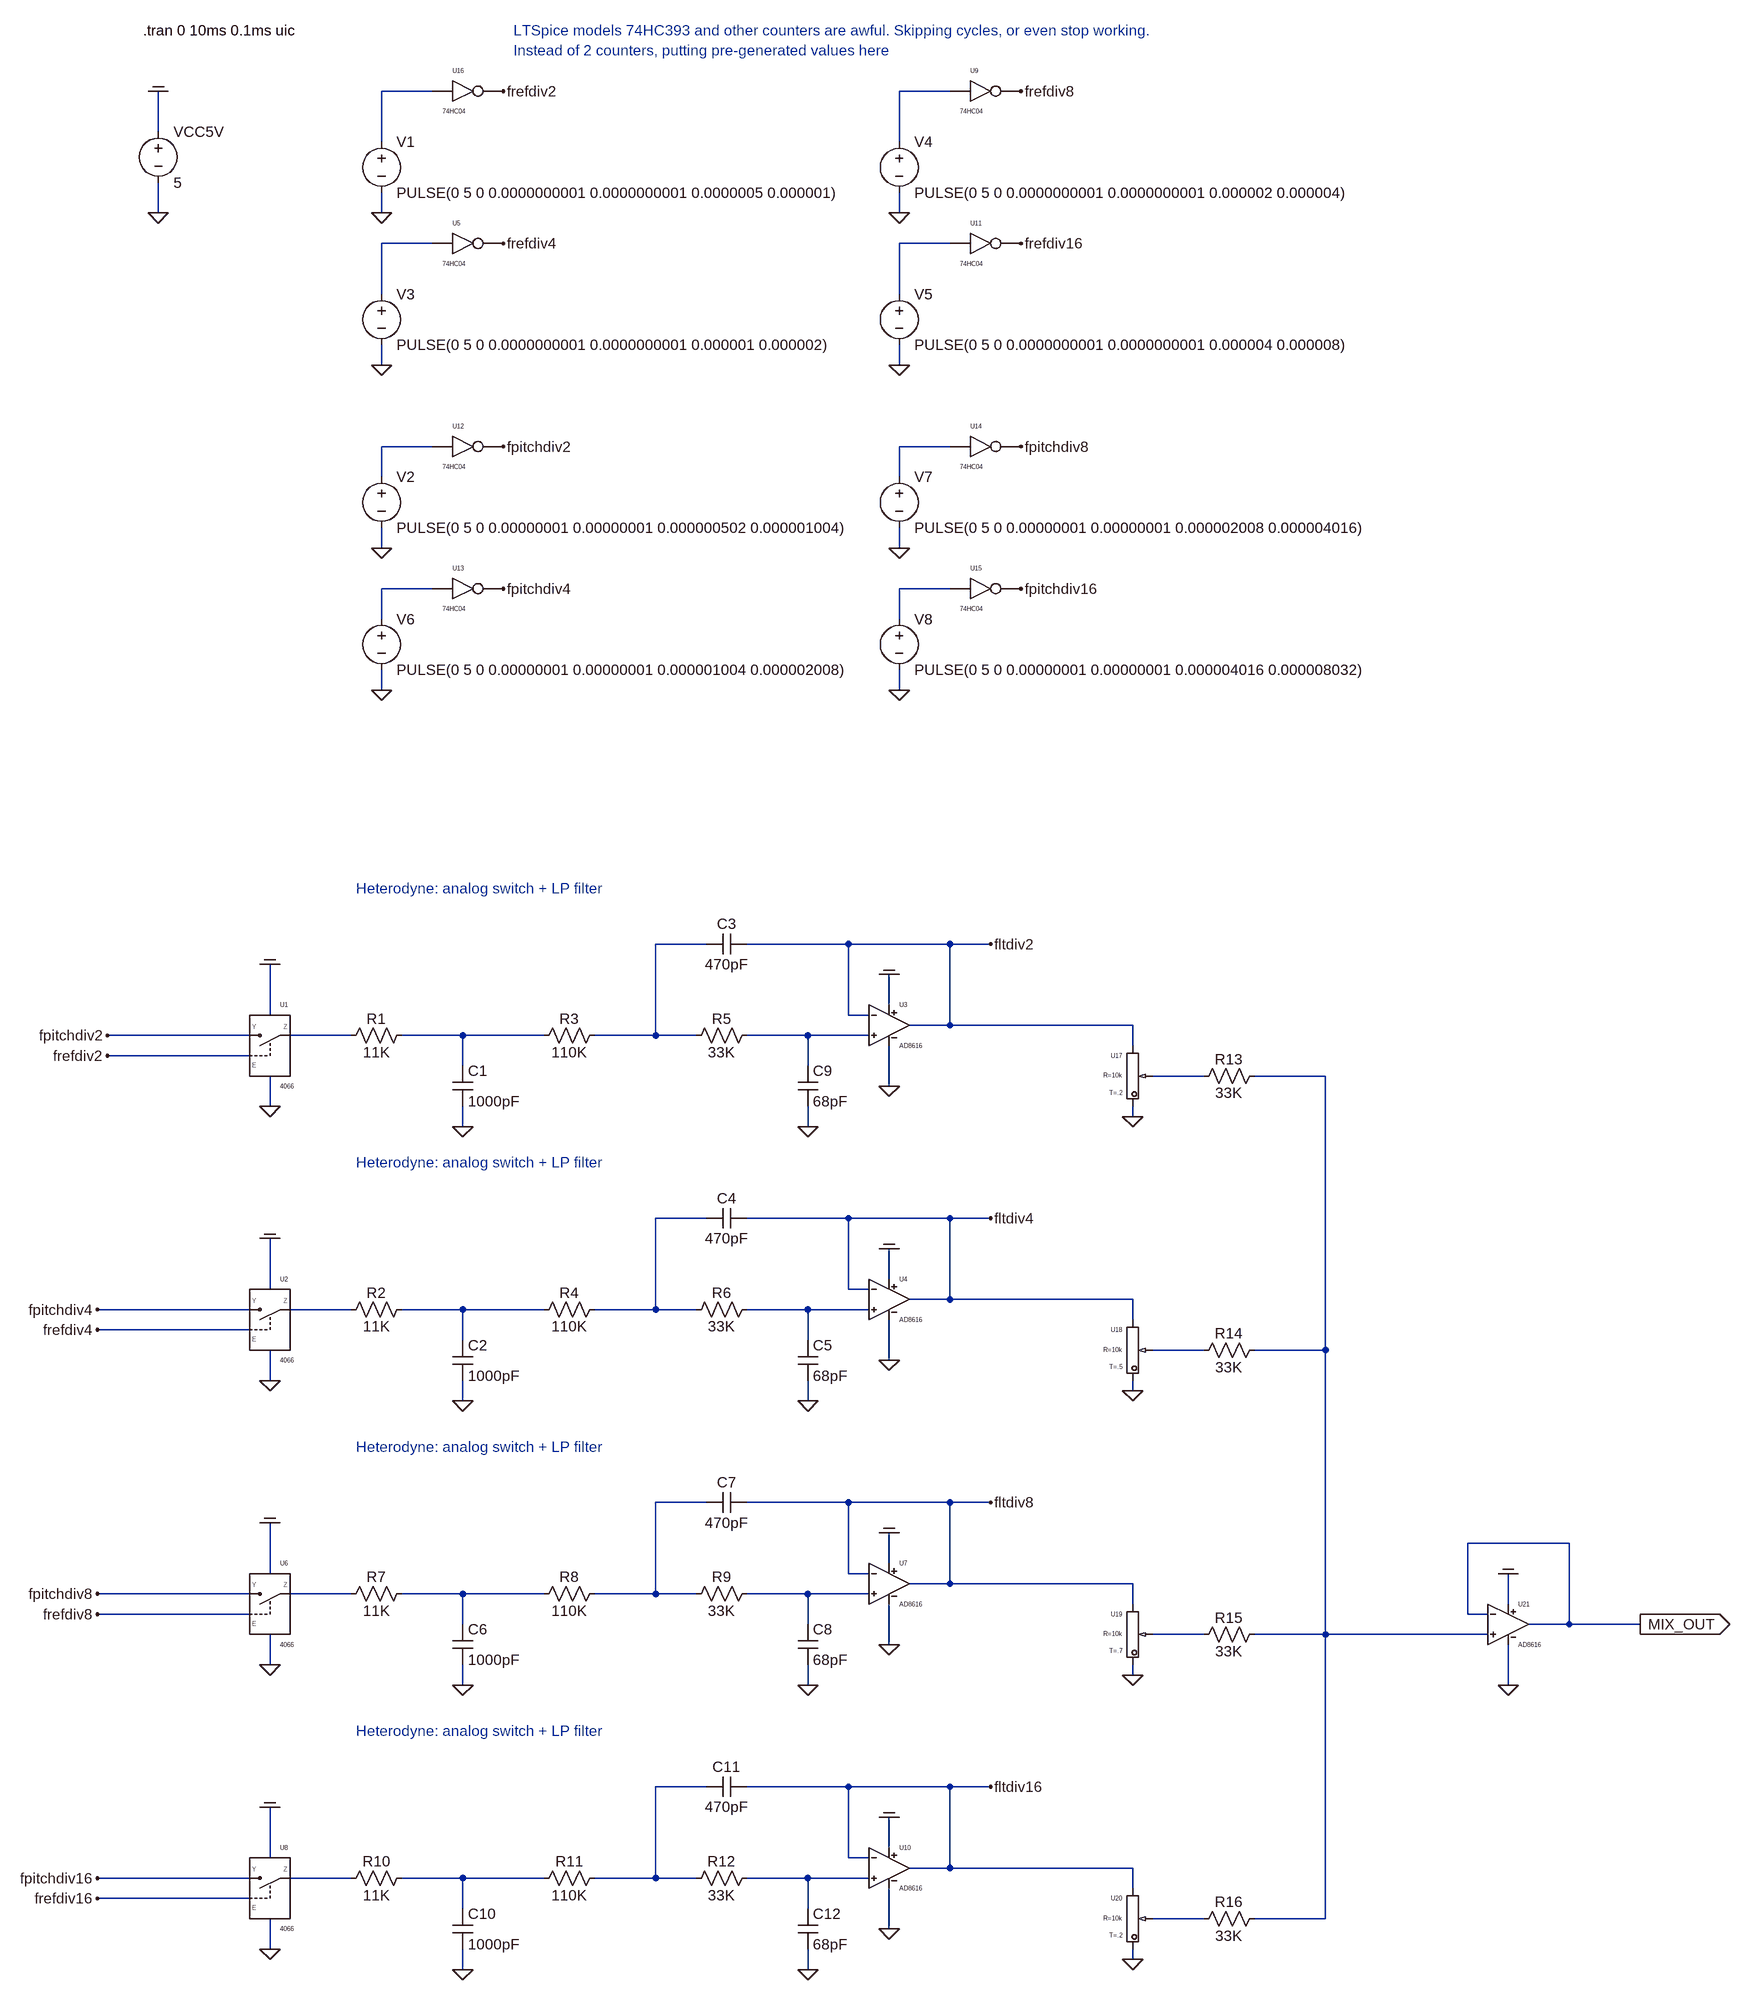
[diagram p0: schematic paradox_mixer_v2_simple.asc]
paradox_mixer_v2_simple.asc, the LTspice schematic file:
Version 4
SHEET 1 880 1476
WIRE -3904 -1616 -3984 -1616
WIRE -3088 -1616 -3168 -1616
WIRE -4336 -1552 -4336 -1616
WIRE -3984 -1536 -3984 -1616
WIRE -3168 -1536 -3168 -1616
WIRE -4336 -1424 -4336 -1472
WIRE -3984 -1424 -3984 -1456
WIRE -3168 -1424 -3168 -1456
WIRE -3904 -1376 -3984 -1376
WIRE -3088 -1376 -3168 -1376
WIRE -3984 -1296 -3984 -1376
WIRE -3168 -1296 -3168 -1376
WIRE -3984 -1184 -3984 -1216
WIRE -3168 -1184 -3168 -1216
WIRE -3904 -1056 -3984 -1056
WIRE -3088 -1056 -3168 -1056
WIRE -3984 -1008 -3984 -1056
WIRE -3168 -1008 -3168 -1056
WIRE -3984 -896 -3984 -928
WIRE -3168 -896 -3168 -928
WIRE -3904 -832 -3984 -832
WIRE -3088 -832 -3168 -832
WIRE -3984 -784 -3984 -832
WIRE -3168 -784 -3168 -832
WIRE -3984 -672 -3984 -704
WIRE -3168 -672 -3168 -704
WIRE -3472 -272 -3552 -272
WIRE -3248 -272 -3408 -272
WIRE -3088 -272 -3248 -272
WIRE -3024 -272 -3088 -272
WIRE -3184 -176 -3184 -224
WIRE -4160 -160 -4160 -240
WIRE -3248 -160 -3248 -272
WIRE -3216 -160 -3248 -160
WIRE -3088 -144 -3088 -272
WIRE -3088 -144 -3152 -144
WIRE -2800 -144 -3088 -144
WIRE -4192 -128 -4416 -128
WIRE -4032 -128 -4128 -128
WIRE -3856 -128 -3952 -128
WIRE -3728 -128 -3856 -128
WIRE -3552 -128 -3552 -272
WIRE -3552 -128 -3648 -128
WIRE -3488 -128 -3552 -128
WIRE -3312 -128 -3408 -128
WIRE -3216 -128 -3312 -128
WIRE -2800 -112 -2800 -144
WIRE -4192 -96 -4416 -96
WIRE -3856 -80 -3856 -128
WIRE -3312 -80 -3312 -128
WIRE -2688 -64 -2768 -64
WIRE -2496 -64 -2608 -64
WIRE -3184 -48 -3184 -112
WIRE -4160 -16 -4160 -64
WIRE -2800 0 -2800 -16
WIRE -3856 16 -3856 -16
WIRE -3312 16 -3312 -16
WIRE -3472 160 -3552 160
WIRE -3248 160 -3408 160
WIRE -3088 160 -3248 160
WIRE -3024 160 -3088 160
WIRE -3184 256 -3184 208
WIRE -4160 272 -4160 192
WIRE -3248 272 -3248 160
WIRE -3216 272 -3248 272
WIRE -3088 288 -3088 160
WIRE -3088 288 -3152 288
WIRE -2800 288 -3088 288
WIRE -4192 304 -4432 304
WIRE -4032 304 -4128 304
WIRE -3856 304 -3952 304
WIRE -3728 304 -3856 304
WIRE -3552 304 -3552 160
WIRE -3552 304 -3648 304
WIRE -3488 304 -3552 304
WIRE -3312 304 -3408 304
WIRE -3216 304 -3312 304
WIRE -2800 320 -2800 288
WIRE -4192 336 -4432 336
WIRE -3856 352 -3856 304
WIRE -3312 352 -3312 304
WIRE -2688 368 -2768 368
WIRE -2496 368 -2496 -64
WIRE -2496 368 -2608 368
WIRE -3184 384 -3184 320
WIRE -4160 416 -4160 368
WIRE -2800 432 -2800 416
WIRE -3856 448 -3856 416
WIRE -3312 448 -3312 416
WIRE -3472 608 -3552 608
WIRE -3248 608 -3408 608
WIRE -3088 608 -3248 608
WIRE -3024 608 -3088 608
WIRE -2112 672 -2272 672
WIRE -3184 704 -3184 656
WIRE -4160 720 -4160 640
WIRE -3248 720 -3248 608
WIRE -3216 720 -3248 720
WIRE -3088 736 -3088 608
WIRE -3088 736 -3152 736
WIRE -2800 736 -3088 736
WIRE -4192 752 -4432 752
WIRE -4032 752 -4128 752
WIRE -3856 752 -3952 752
WIRE -3728 752 -3856 752
WIRE -3552 752 -3552 608
WIRE -3552 752 -3648 752
WIRE -3488 752 -3552 752
WIRE -3312 752 -3408 752
WIRE -3216 752 -3312 752
WIRE -2800 768 -2800 736
WIRE -2208 768 -2208 720
WIRE -4192 784 -4432 784
WIRE -2272 784 -2272 672
WIRE -2240 784 -2272 784
WIRE -3856 800 -3856 752
WIRE -3312 800 -3312 752
WIRE -2112 800 -2112 672
WIRE -2112 800 -2176 800
WIRE -2000 800 -2112 800
WIRE -2688 816 -2768 816
WIRE -2496 816 -2496 368
WIRE -2496 816 -2608 816
WIRE -2240 816 -2496 816
WIRE -3184 832 -3184 768
WIRE -4160 864 -4160 816
WIRE -2800 880 -2800 864
WIRE -3856 896 -3856 864
WIRE -3312 896 -3312 864
WIRE -2208 896 -2208 832
WIRE -3472 1056 -3552 1056
WIRE -3248 1056 -3408 1056
WIRE -3088 1056 -3248 1056
WIRE -3024 1056 -3088 1056
WIRE -3184 1152 -3184 1104
WIRE -4160 1168 -4160 1088
WIRE -3248 1168 -3248 1056
WIRE -3216 1168 -3248 1168
WIRE -3088 1184 -3088 1056
WIRE -3088 1184 -3152 1184
WIRE -2800 1184 -3088 1184
WIRE -4192 1200 -4432 1200
WIRE -4032 1200 -4128 1200
WIRE -3856 1200 -3952 1200
WIRE -3728 1200 -3856 1200
WIRE -3552 1200 -3552 1056
WIRE -3552 1200 -3648 1200
WIRE -3488 1200 -3552 1200
WIRE -3312 1200 -3408 1200
WIRE -3216 1200 -3312 1200
WIRE -2800 1216 -2800 1184
WIRE -4192 1232 -4432 1232
WIRE -3856 1248 -3856 1200
WIRE -3312 1248 -3312 1200
WIRE -2688 1264 -2768 1264
WIRE -2496 1264 -2496 816
WIRE -2496 1264 -2608 1264
WIRE -3184 1280 -3184 1216
WIRE -4160 1312 -4160 1264
WIRE -2800 1328 -2800 1312
WIRE -3856 1344 -3856 1312
WIRE -3312 1344 -3312 1312
FLAG -4336 -1616 COM
FLAG -4336 -1424 0
FLAG -3984 -1424 0
FLAG -3984 -896 0
FLAG -3856 16 0
FLAG -3792 -1616 frefdiv2
FLAG -4416 -128 fpitchdiv2
FLAG -4160 -240 COM
FLAG -4160 -16 0
FLAG -3184 -48 0
FLAG -3184 -224 COM
FLAG -3024 -272 fltdiv2
FLAG -4416 -96 frefdiv2
FLAG -3312 16 0
FLAG -4432 304 fpitchdiv4
FLAG -4160 192 COM
FLAG -4160 416 0
FLAG -3184 384 0
FLAG -3184 208 COM
FLAG -3024 160 fltdiv4
FLAG -4432 336 frefdiv4
FLAG -4432 752 fpitchdiv8
FLAG -4160 640 COM
FLAG -4160 864 0
FLAG -3184 832 0
FLAG -3184 656 COM
FLAG -3024 608 fltdiv8
FLAG -4432 784 frefdiv8
FLAG -4432 1200 fpitchdiv16
FLAG -4160 1088 COM
FLAG -4160 1312 0
FLAG -3184 1280 0
FLAG -3184 1104 COM
FLAG -3024 1056 fltdiv16
FLAG -4432 1232 frefdiv16
FLAG -3984 -1184 0
FLAG -3792 -1376 frefdiv4
FLAG -3168 -1424 0
FLAG -2976 -1616 frefdiv8
FLAG -3168 -1184 0
FLAG -2976 -1376 frefdiv16
FLAG -3792 -1056 fpitchdiv2
FLAG -3984 -672 0
FLAG -3792 -832 fpitchdiv4
FLAG -3168 -896 0
FLAG -2976 -1056 fpitchdiv8
FLAG -3168 -672 0
FLAG -2976 -832 fpitchdiv16
FLAG -3856 448 0
FLAG -3312 448 0
FLAG -3856 896 0
FLAG -3312 896 0
FLAG -3856 1344 0
FLAG -3312 1344 0
FLAG -2800 0 0
FLAG -2800 432 0
FLAG -2800 880 0
FLAG -2800 1328 0
FLAG -2208 896 0
FLAG -2208 720 COM
FLAG -2000 800 MIX_OUT
IOPIN -2000 800 Out
SYMBOL voltage -4336 -1568 R0
WINDOW 123 0 0 Left 2
WINDOW 39 0 0 Left 2
SYMATTR InstName VCC5V
SYMATTR Value 5
SYMBOL voltage -3984 -1552 R0
WINDOW 123 0 0 Left 2
WINDOW 39 0 0 Left 2
SYMATTR InstName V1
SYMATTR Value PULSE(0 5 0 0.0000000001 0.0000000001 0.0000005 0.000001)
SYMBOL voltage -3984 -1024 R0
WINDOW 123 0 0 Left 2
WINDOW 39 0 0 Left 2
SYMATTR InstName V2
SYMATTR Value PULSE(0 5 0 0.00000001 0.00000001 0.000000502 0.000001004)
SYMBOL res -4048 -112 R270
WINDOW 0 27 56 VTop 2
WINDOW 3 5 56 VBottom 2
SYMATTR InstName R1
SYMATTR Value 11K
SYMBOL cap -3872 -80 R0
SYMATTR InstName C1
SYMATTR Value 1000pF
SYMBOL res -3632 -144 R90
WINDOW 0 5 56 VBottom 2
WINDOW 3 27 56 VTop 2
SYMATTR InstName R3
SYMATTR Value 110K
SYMBOL cap -3408 -288 R90
WINDOW 0 0 32 VBottom 2
WINDOW 3 32 32 VTop 2
SYMATTR InstName C3
SYMATTR Value 470pF
SYMBOL cd4066 -4160 -112 R0
SYMATTR InstName U1
SYMBOL AD8616 -3184 -144 R0
SYMATTR InstName U3
SYMBOL res -3392 -144 R90
WINDOW 0 5 56 VBottom 2
WINDOW 3 27 56 VTop 2
SYMATTR InstName R5
SYMATTR Value 33K
SYMBOL cap -3328 -80 R0
SYMATTR InstName C9
SYMATTR Value 68pF
SYMBOL cd4066 -4160 320 R0
SYMATTR InstName U2
SYMBOL AD8616 -3184 288 R0
SYMATTR InstName U4
SYMBOL cd4066 -4160 768 R0
SYMATTR InstName U6
SYMBOL AD8616 -3184 736 R0
SYMATTR InstName U7
SYMBOL cd4066 -4160 1216 R0
SYMATTR InstName U8
SYMBOL AD8616 -3184 1184 R0
SYMATTR InstName U10
SYMBOL 74hc04 -3856 -1680 R0
SYMATTR InstName U16
SYMBOL voltage -3984 -1312 R0
WINDOW 123 0 0 Left 2
WINDOW 39 0 0 Left 2
SYMATTR InstName V3
SYMATTR Value PULSE(0 5 0 0.0000000001 0.0000000001 0.000001 0.000002)
SYMBOL 74hc04 -3856 -1440 R0
SYMATTR InstName U5
SYMBOL voltage -3168 -1552 R0
WINDOW 123 0 0 Left 2
WINDOW 39 0 0 Left 2
SYMATTR InstName V4
SYMATTR Value PULSE(0 5 0 0.0000000001 0.0000000001 0.000002 0.000004)
SYMBOL 74hc04 -3040 -1680 R0
SYMATTR InstName U9
SYMBOL voltage -3168 -1312 R0
WINDOW 123 0 0 Left 2
WINDOW 39 0 0 Left 2
SYMATTR InstName V5
SYMATTR Value PULSE(0 5 0 0.0000000001 0.0000000001 0.000004 0.000008)
SYMBOL 74hc04 -3040 -1440 R0
SYMATTR InstName U11
SYMBOL 74hc04 -3856 -1120 R0
SYMATTR InstName U12
SYMBOL voltage -3984 -800 R0
WINDOW 123 0 0 Left 2
WINDOW 39 0 0 Left 2
SYMATTR InstName V6
SYMATTR Value PULSE(0 5 0 0.00000001 0.00000001 0.000001004 0.000002008)
SYMBOL 74hc04 -3856 -896 R0
SYMATTR InstName U13
SYMBOL voltage -3168 -1024 R0
WINDOW 123 0 0 Left 2
WINDOW 39 0 0 Left 2
SYMATTR InstName V7
SYMATTR Value PULSE(0 5 0 0.00000001 0.00000001 0.000002008 0.000004016)
SYMBOL 74hc04 -3040 -1120 R0
SYMATTR InstName U14
SYMBOL voltage -3168 -800 R0
WINDOW 123 0 0 Left 2
WINDOW 39 0 0 Left 2
SYMATTR InstName V8
SYMATTR Value PULSE(0 5 0 0.00000001 0.00000001 0.000004016 0.000008032)
SYMBOL 74hc04 -3040 -896 R0
SYMATTR InstName U15
SYMBOL res -4048 320 R270
WINDOW 0 27 56 VTop 2
WINDOW 3 5 56 VBottom 2
SYMATTR InstName R2
SYMATTR Value 11K
SYMBOL cap -3872 352 R0
SYMATTR InstName C2
SYMATTR Value 1000pF
SYMBOL res -3632 288 R90
WINDOW 0 5 56 VBottom 2
WINDOW 3 27 56 VTop 2
SYMATTR InstName R4
SYMATTR Value 110K
SYMBOL cap -3408 144 R90
WINDOW 0 0 32 VBottom 2
WINDOW 3 32 32 VTop 2
SYMATTR InstName C4
SYMATTR Value 470pF
SYMBOL res -3392 288 R90
WINDOW 0 5 56 VBottom 2
WINDOW 3 27 56 VTop 2
SYMATTR InstName R6
SYMATTR Value 33K
SYMBOL cap -3328 352 R0
SYMATTR InstName C5
SYMATTR Value 68pF
SYMBOL res -4048 768 R270
WINDOW 0 27 56 VTop 2
WINDOW 3 5 56 VBottom 2
SYMATTR InstName R7
SYMATTR Value 11K
SYMBOL cap -3872 800 R0
SYMATTR InstName C6
SYMATTR Value 1000pF
SYMBOL res -3632 736 R90
WINDOW 0 5 56 VBottom 2
WINDOW 3 27 56 VTop 2
SYMATTR InstName R8
SYMATTR Value 110K
SYMBOL cap -3408 592 R90
WINDOW 0 0 32 VBottom 2
WINDOW 3 32 32 VTop 2
SYMATTR InstName C7
SYMATTR Value 470pF
SYMBOL res -3392 736 R90
WINDOW 0 5 56 VBottom 2
WINDOW 3 27 56 VTop 2
SYMATTR InstName R9
SYMATTR Value 33K
SYMBOL cap -3328 800 R0
SYMATTR InstName C8
SYMATTR Value 68pF
SYMBOL res -4048 1216 R270
WINDOW 0 27 56 VTop 2
WINDOW 3 5 56 VBottom 2
SYMATTR InstName R10
SYMATTR Value 11K
SYMBOL cap -3872 1248 R0
SYMATTR InstName C10
SYMATTR Value 1000pF
SYMBOL res -3632 1184 R90
WINDOW 0 5 56 VBottom 2
WINDOW 3 27 56 VTop 2
SYMATTR InstName R11
SYMATTR Value 110K
SYMBOL cap -3408 1040 R90
WINDOW 0 0 32 VBottom 2
WINDOW 3 32 32 VTop 2
SYMATTR InstName C11
SYMATTR Value 470pF
SYMBOL res -3392 1184 R90
WINDOW 0 5 56 VBottom 2
WINDOW 3 27 56 VTop 2
SYMATTR InstName R12
SYMATTR Value 33K
SYMBOL cap -3328 1248 R0
SYMATTR InstName C12
SYMATTR Value 68pF
SYMBOL pot -2800 -64 M0
SYMATTR InstName U17
SYMATTR Value2 T=.2
SYMBOL pot -2800 368 M0
SYMATTR InstName U18
SYMBOL pot -2800 816 M0
SYMATTR InstName U19
SYMATTR Value2 T=.7
SYMBOL pot -2800 1264 M0
SYMATTR InstName U20
SYMATTR Value2 T=.2
SYMBOL res -2592 -80 R90
WINDOW 0 5 56 VBottom 2
WINDOW 3 27 56 VTop 2
SYMATTR InstName R13
SYMATTR Value 33K
SYMBOL res -2592 352 R90
WINDOW 0 5 56 VBottom 2
WINDOW 3 27 56 VTop 2
SYMATTR InstName R14
SYMATTR Value 33K
SYMBOL res -2592 800 R90
WINDOW 0 5 56 VBottom 2
WINDOW 3 27 56 VTop 2
SYMATTR InstName R15
SYMATTR Value 33K
SYMBOL res -2592 1248 R90
WINDOW 0 5 56 VBottom 2
WINDOW 3 27 56 VTop 2
SYMATTR InstName R16
SYMATTR Value 33K
SYMBOL AD8616 -2208 800 R0
SYMATTR InstName U21
TEXT -4360 -1712 Left 2 !.tran 0 10ms 0.1ms uic
TEXT -4024 -360 Left 2 ;Heterodyne: analog switch + LP filter
TEXT -4024 72 Left 2 ;Heterodyne: analog switch + LP filter
TEXT -4024 520 Left 2 ;Heterodyne: analog switch + LP filter
TEXT -4024 968 Left 2 ;Heterodyne: analog switch + LP filter
TEXT -3776 -1712 Left 2 ;LTSpice models 74HC393 and other counters are awful. Skipping cycles, or even stop working.\nInstead of 2 counters, putting pre-generated values here

The netlist it stands for:
* paradox_mixer_v2_simple.asc
VCC5V COM 0 5
V1 N001 0 PULSE(0 5 0 0.0000000001 0.0000000001 0.0000005 0.000001)
V2 N005 0 PULSE(0 5 0 0.00000001 0.00000001 0.000000502 0.000001004)
R1 N010 N011 11K
C1 N011 0 1000pF
R3 N009 N011 110K
C3 fltdiv2 N009 470pF
XU1 fpitchdiv2 N010 frefdiv2 COM 0 4066  ; pins Y OUT EN VCC VSS
XU3 N012 fltdiv2 COM 0 fltdiv2 AD8616  ; pins In+ In- V+ V- OUT
R5 N012 N009 33K
C9 N012 0 68pF
XU2 fpitchdiv4 N016 frefdiv4 COM 0 4066  ; pins Y OUT EN VCC VSS
XU4 N018 fltdiv4 COM 0 fltdiv4 AD8616  ; pins In+ In- V+ V- OUT
XU6 fpitchdiv8 N021 frefdiv8 COM 0 4066  ; pins Y OUT EN VCC VSS
XU7 N023 fltdiv8 COM 0 fltdiv8 AD8616  ; pins In+ In- V+ V- OUT
XU8 fpitchdiv16 N026 frefdiv16 COM 0 4066  ; pins Y OUT EN VCC VSS
XU10 N028 fltdiv16 COM 0 fltdiv16 AD8616  ; pins In+ In- V+ V- OUT
XU16 N001 frefdiv2 VCC 0 74HC04 VCC=5  SPEED=1.0  TRIPDT=1e-9  ; pins A Y
V3 N003 0 PULSE(0 5 0 0.0000000001 0.0000000001 0.000001 0.000002)
XU5 N003 frefdiv4 VCC 0 74HC04 VCC=5  SPEED=1.0  TRIPDT=1e-9  ; pins A Y
V4 N002 0 PULSE(0 5 0 0.0000000001 0.0000000001 0.000002 0.000004)
XU9 N002 frefdiv8 VCC 0 74HC04 VCC=5  SPEED=1.0  TRIPDT=1e-9  ; pins A Y
V5 N004 0 PULSE(0 5 0 0.0000000001 0.0000000001 0.000004 0.000008)
XU11 N004 frefdiv16 VCC 0 74HC04 VCC=5  SPEED=1.0  TRIPDT=1e-9  ; pins A Y
XU12 N005 fpitchdiv2 VCC 0 74HC04 VCC=5  SPEED=1.0  TRIPDT=1e-9  ; pins A Y
V6 N007 0 PULSE(0 5 0 0.00000001 0.00000001 0.000001004 0.000002008)
XU13 N007 fpitchdiv4 VCC 0 74HC04 VCC=5  SPEED=1.0  TRIPDT=1e-9  ; pins A Y
V7 N006 0 PULSE(0 5 0 0.00000001 0.00000001 0.000002008 0.000004016)
XU14 N006 fpitchdiv8 VCC 0 74HC04 VCC=5  SPEED=1.0  TRIPDT=1e-9  ; pins A Y
V8 N008 0 PULSE(0 5 0 0.00000001 0.00000001 0.000004016 0.000008032)
XU15 N008 fpitchdiv16 VCC 0 74HC04 VCC=5  SPEED=1.0  TRIPDT=1e-9  ; pins A Y
R2 N016 N017 11K
C2 N017 0 1000pF
R4 N015 N017 110K
C4 fltdiv4 N015 470pF
R6 N018 N015 33K
C5 N018 0 68pF
R7 N021 N022 11K
C6 N022 0 1000pF
R8 N020 N022 110K
C7 fltdiv8 N020 470pF
R9 N023 N020 33K
C8 N023 0 68pF
R10 N026 N027 11K
C10 N027 0 1000pF
R11 N025 N027 110K
C11 fltdiv16 N025 470pF
R12 N028 N025 33K
C12 N028 0 68pF
XU17 fltdiv2 0 N013 pot R=10k T=.2  ; pins A B C
XU18 fltdiv4 0 N019 pot R=10k T=.5  ; pins A B C
XU19 fltdiv8 0 N024 pot R=10k T=.7  ; pins A B C
XU20 fltdiv16 0 N029 pot R=10k T=.2  ; pins A B C
R13 N014 N013 33K
R14 N014 N019 33K
R15 N014 N024 33K
R16 N014 N029 33K
XU21 N014 MIX_OUT COM 0 MIX_OUT AD8616  ; pins In+ In- V+ V- OUT
.tran 0 10ms 0.1ms uic
* Heterodyne: analog switch + LP filter
* Heterodyne: analog switch + LP filter
* Heterodyne: analog switch + LP filter
* Heterodyne: analog switch + LP filter
* LTSpice models 74HC393 and other counters are awful. Skipping cycles, or even stop working.
* Instead of 2 counters, putting pre-generated values here
.lib SwitchAna.lib
.lib AD8616.cir
.lib 74HC.lib
.lib pot.lib
.backanno
.end